# Altium schematic sheet Root.SchDoc
size A3; SheetNumber: 1; SheetTotal: 6
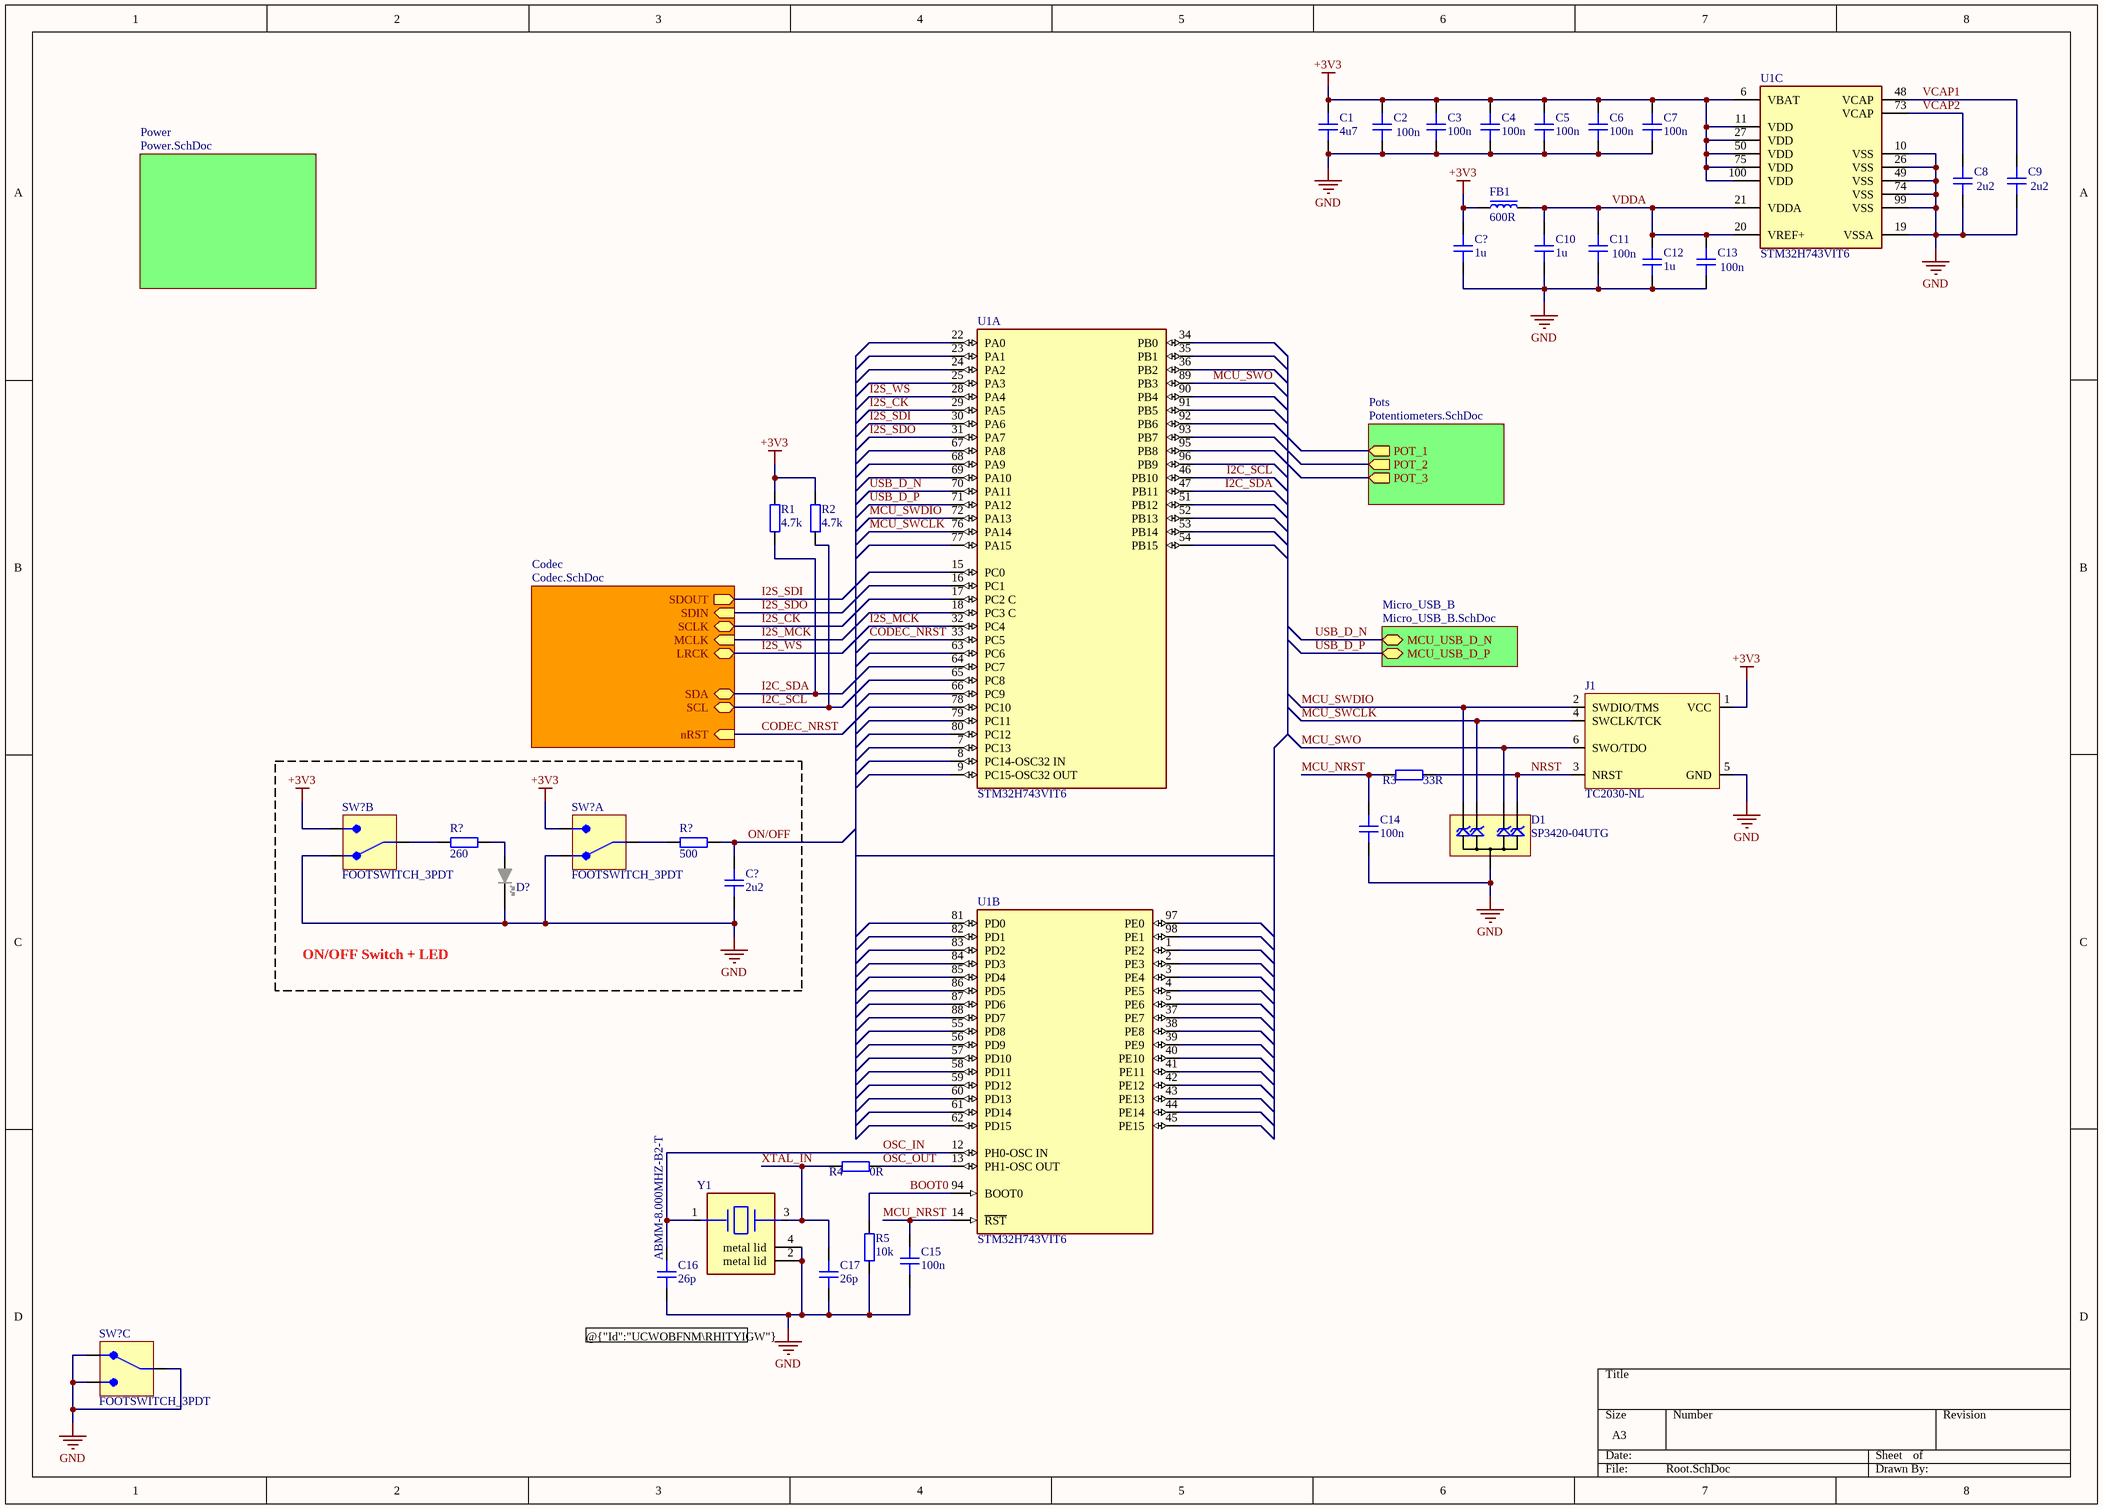
[diagram p0: Root.SchDoc]

## Parts
(Parts that share a designator on the sheet are numbered #1, #2 ... from top to bottom, then left to right.)
C1  4u7  [CAP_0603]
C2  100n  [CAP_0402]
C3  100n  [CAP_0402]
C4  100n  [CAP_0402]
C5  100n  [CAP_0402]
C6  100n  [CAP_0402]
C7  100n  [CAP_0402]
C8  2u2  [CAP_0402]
C9  2u2  [CAP_0402]
C10  1u  [CAP_0603]
C11  100n  [CAP_0402]
C12  1u  [CAP_0603]
C13  100n  [CAP_0402]
C14  100n  [CAP_0402]
C15  100n  [CAP_0402]
C16  26p  [CAP_0402]
C17  26p  [CAP_0402]
C?#1  1u  [CAP_0603]
C?#2  2u2  [CAP_0603]
D1  SP3420-04UTG  [uDFN-10]
D?  LED  [SLM-490]  (value not drawn)
FB1  600R  [FB_0805]
J1  TC2030-NL  [TC2030-NL-FP]  (no BOM)
R1  4.7k  [RES_0402]
R2  4.7k  [RES_0402]
R3  33R  [RES_0402]
R4  0R  [RES_0402]
R5  10k  [RES_0402]
R?#1  260  [RES_0603]
R?#2  500  [RES_0603]
SW?#1  FOOTSWITCH_3PDT  [FOOTSWITCH_3PDT]  (part B of 3)
SW?#2  FOOTSWITCH_3PDT  [FOOTSWITCH_3PDT]  (part A of 3)
SW?#3  FOOTSWITCH_3PDT  [FOOTSWITCH_3PDT]  (part C of 3)
U1  STM32H743VIT6  [FP-LQFP100-1L-MFG]  (parts A,B,C of 3)
Y1  ABMM-8.000MHZ-B2-T  [FP-ABMM-MFG]

## Blocks framed on the sheet
ON/OFF Switch + LED: C?#2 D? R?#1 R?#2 SW?#1 SW?#2

## Sub-sheets
Codec = Codec.SchDoc: SDIN (in), SDOUT (out), LRCK (bidir), SCLK (bidir), MCLK (in), SDA (bidir), SCL (bidir), nRST (in)
Micro_USB_B = Micro_USB_B.SchDoc: MCU_USB_D_N (bidir), MCU_USB_D_P (bidir)
Pots = Potentiometers.SchDoc: POT_1 (out), POT_2 (out), POT_3 (out)
Power = Power.SchDoc: no entries

## Nets
+3V3: C1.2 C2.2 C3.2 C4.2 C5.2 C6.2 C7.2 C?#1.2 FB1.1 J1.1(VCC) R1.2 R2.2 SW?#1.NO2 SW?#2.NO1 U1.6(VBAT) U1.11(VDD) U1.27(VDD) U1.50(VDD) U1.75(VDD) U1.100(VDD)
GND: C1.1 C2.1 C3.1 C4.1 C5.1 C6.1 C7.1 C8.1 C9.1 C10.1 C11.1 C12.1 C13.1 C14.1 C15.1 C16.1 C17.1 C?#1.1 C?#2.1 D1.38(GND) D?.K J1.5(GND) R5.1 SW?#1.NC2 SW?#2.NC1 SW?#3.COM3 SW?#3.NC3 SW?#3.NO3 U1.10(VSS) U1.19(VSSA) U1.26(VSS) U1.49(VSS) U1.74(VSS) U1.99(VSS) Y1.2(metal_lid) Y1.4(metal_lid)
BOOT0: R5.2 U1.94(BOOT0)
CODEC_NRST: U1.33(PC5) ; sheet Codec/nRST
I2C_SCL: R2.1 U1.46(PB10) ; sheet Codec/SCL
I2C_SDA: R1.1 U1.47(PB11) ; sheet Codec/SDA
I2S_CK: U1.29(PA5) ; sheet Codec/SCLK
I2S_MCK: U1.32(PC4) ; sheet Codec/MCLK
I2S_SDI: U1.30(PA6) ; sheet Codec/SDOUT
I2S_SDO: U1.31(PA7) ; sheet Codec/SDIN
I2S_WS: U1.28(PA4) ; sheet Codec/LRCK
MCU_NRST: C14.2 C15.2 R3.1 U1.14(~{RST})
MCU_SWCLK: D1.29 J1.4(SWCLK/TCK) U1.76(PA14)
MCU_SWDIO: D1.110 J1.2(SWDIO/TMS) U1.72(PA13)
MCU_SWO: D1.47 J1.6(SWO/TDO) U1.89(PB3)
NRST: D1.56 J1.3(NRST) R3.2
ON/OFF: C?#2.2 R?#2.1
OSC_IN: C16.2 U1.12(PH0-OSC_IN) Y1.1
OSC_OUT: R4.2 U1.13(PH1-OSC_OUT)
USB_D_N: U1.70(PA11) ; sheet Micro_USB_B/MCU_USB_D_N
USB_D_P: U1.71(PA12) ; sheet Micro_USB_B/MCU_USB_D_P
VCAP1: C9.2 U1.48(VCAP)
VCAP2: C8.2 U1.73(VCAP)
VDDA: C10.2 C11.2 C12.2 C13.2 FB1.2 U1.20(VREF+) U1.21(VDDA)
XTAL_IN: C17.2 R4.1 Y1.3
NetD?_A: D?.A R?#1.1
NetR?#1_2: R?#1.2 SW?#1.COM2
NetR?#2_2: R?#2.2 SW?#2.COM1

Not connected (* = marked no-connect by the designer): U1 1(PE2) 2(PE3) 3(PE4) 4(PE5) 5(PE6) 7(PC13) 8(PC14-OSC32_IN) 9(PC15-OSC32_OUT) 15(PC0) 16(PC1) 17(PC2_C) 18(PC3_C) 22(PA0) 23(PA1) 24(PA2) 25(PA3) 34(PB0) 35(PB1) 36(PB2) 37(PE7) 38(PE8) 39(PE9) 40(PE10) 41(PE11) 42(PE12) 43(PE13) 44(PE14) 45(PE15) 51(PB12) 52(PB13) 53(PB14) 54(PB15) 55(PD8) 56(PD9) 57(PD10) 58(PD11) 59(PD12) 60(PD13) 61(PD14) 62(PD15) 63(PC6) 64(PC7) 65(PC8) 66(PC9) 67(PA8) 68(PA9) 69(PA10) 77(PA15) 78(PC10) 79(PC11) 80(PC12) 81(PD0) 82(PD1) 83(PD2) 84(PD3) 85(PD4) 86(PD5) 87(PD6) 88(PD7) 90(PB4) 91(PB5) 92(PB6) 93(PB7) 95(PB8) 96(PB9) 97(PE0) 98(PE1)

## Notes on the sheet
- (near C16) @{"Id":"UCWOBFNM\RHITYIGW"} & @{"Id":"UCWOBFNM\OAWXIDPK"} Class I Capacitors

## Library data of the parts
C1 C10 C12 C?#1 = CAP_0603: 16V; Manufacturer: *; Manufacturer Part Number: *; Distributor Link: *; LCSC: *; Rating: *; Dielectric: *
C2-C9 C11 C13-C15 = CAP_0402: 16V; Manufacturer: *; Manufacturer Part Number: *; Distributor Link: *; LCSC: *; Rating: *; Dielectric: *
C16 C17 = CAP_0402: Capacitor SMD 0402; Manufacturer: *; Manufacturer Part Number: *; Distributor Link: *; LCSC: *; Rating: *; Dielectric: *
C?#2 = CAP_0603: Capacitor SMD 0603; Manufacturer: *; Manufacturer Part Number: *; Distributor Link: *; LCSC: *; Rating: *; Dielectric: *
D1 = SP3420-04UTG: TVS Diode Array Low Capacitance ESD Protection 4-Channel (Vwork=3V3, Vclamp=6V); Manufacturer: Littelfuse; Manufacturer Part Number: SP3420-04UTG
D? = LED_5MM_HOLDER_16MM1: 5mm LED Holder Height 16.1mm (w/o LED); Manufacturer: BIVAR; Manufacturer Part Number: SLM-490
FB1 = FB_0805: 300mOhm DC, 600R @ 100MHz; Manufacturer: *; Manufacturer Part Number: *; Distributor Link: *; LCSC: *
J1 = TC2030-NL: Tag-Connect No-Solder SWD Debug Connector (No Legs) DO NOT PLACE; Manufacturer: Tag-Connect; Manufacturer Part Number: TC2030-NL-FP
R1-R5 = RES_0402: Resistor SMD 0402; Manufacturer: *; Manufacturer Part Number: *; Distributor Link: *; LCSC: *
R?#1 R?#2 = RES_0603: Resistor SMD 0603; Manufacturer: *; Manufacturer Part Number: *; Distributor Link: *; LCSC: *
SW?#1-SW?#3 = FOOTSWITCH_3PDT: Generic 3PDT Footswitch; Manufacturer: *; Manufacturer Part Number: *; Link: https://lovemyswitches.com/3pdt-latched-foot-switch-solder-lugs-black/
U1 = CMP-12105-000050-1: IC MCU 32BIT 2MB FLASH 100LQFP; Manufacturer: STMicroelectronics; Number Of Ethernet Channels: 1; Number Of Usb Channels: 2; Number Of A/D Converters: 3; Min Supply Voltage: 1.71V; Ram Size: 1060KBytes; Number Of I2C Channels: 4; Frequency: 480MHz; Number Of Adc Channels: 36; Number Of I/Os: 82; Max Supply Voltage: 3.6V; Number Of Spi Channels: 6; Memory Size: 2MBytes; Max Junction Temp: +125°C; Core Architecture: Arm Cortex-M7; Interface: I2C,SPI,UART,USART,USB,LIN,IrDA,Ethernet,I2S,Other; Number Of Timers/Counters: 20; Data Bus Width: 32bits; Number Of Pwm Channels: 42; Number Of Uart Channels: 9; Standoff Height: 0.05mm; Device Class L1: Integrated Circuits (ICs); ComponentLink2URL: https://www.st.com/resource/en/datasheet/stm32h743vi.pdf; Automotive: No; Memory Type: FLASH; Number Of Cores: 1; Temperature Range Low: -40°C; RoHS: TRUE; Ambient Temperature Range Low: -40°C; ComponentLink2Description: Datasheet; Device Class L2: Embedded Processors and Controllers; Device Class L3: Microcontrollers; Digikey Description: IC MCU 32BIT 2MB FLASH 100LQFP; Temperature Range High: +125°C; Ambient Temperature Range High: +85°C; Package: LQFP100-1L; Temperature: -40°C to +125°C; Category: IC; Ipc Land Pattern Name: QFP50P1600X1600X160-100; Height: 1.6mm; Manufacturer Part Number: STM32H743VIT6; Octopart: https://octopart.com/stm32h743vit6-stmicroelectronics-76372527; Lead Free: Yes
Y1 = CMP-27762-006043-1: CRYSTAL 8.0000MHZ 18PF SMD; Tolerance: 20ppm; Frequency: 8MHz; Frequency Stability: 50ppm; Operating Frequency: 8 MHz; ESR (Equivalent Series Resistance): 70R; Package Quantity: 1000; Number of Pins: 4; Mount: Surface Mount; Accuracy: 20ppm; Depth: 5.2mm; Resistor Type: Ceramic; Lead Free: Lead Free; Series: ABMM; Packaging: Tape and Reel; Length: 7.2mm; REACH SVHC: No SVHC; Termination: SMD/SMT; Load Capacitance: 18pF; Case/Package: CSMD; Width: 0.197inch; Max Operating Temperature: 70°C; Radiation Hardening: No; Series Resistance: 70R; Frequency Tolerance: 20ppm; Min Operating Temperature: -20°C; Height: 0.051inch